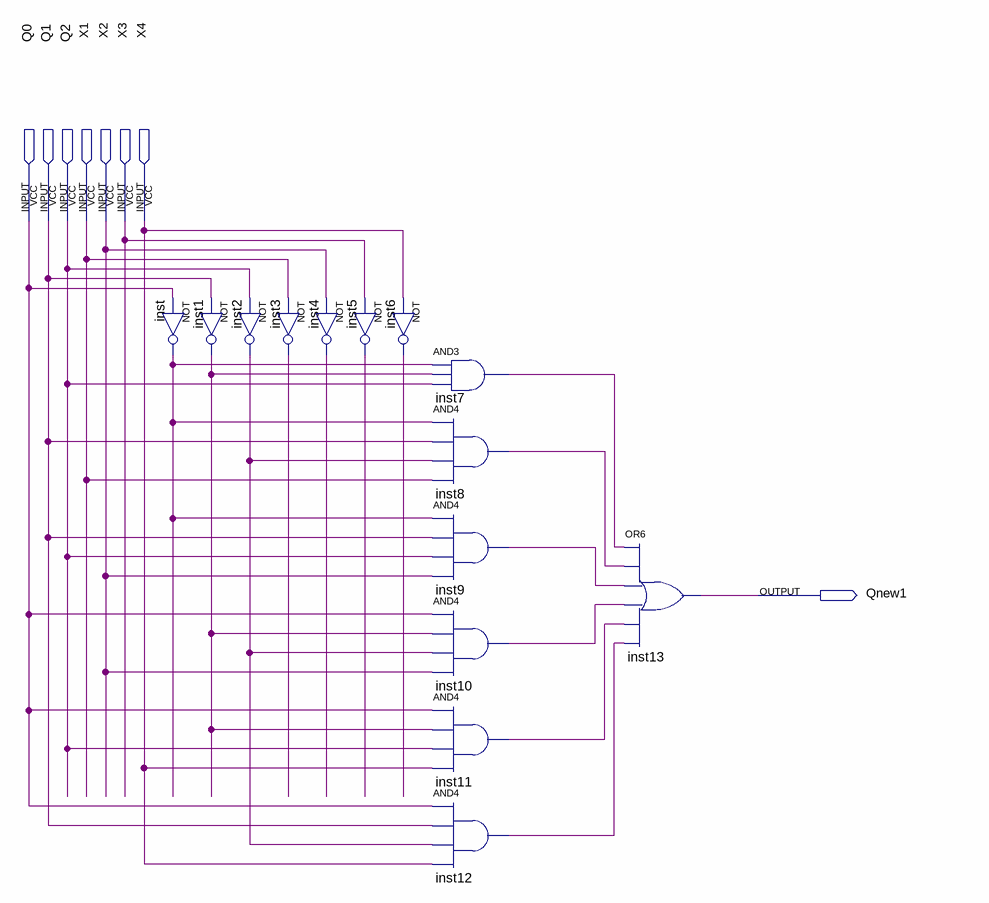
[diagram p0: schematic sheet]
// Quartus schematic Q1_n.bdf as structural Verilog: 14 symbols, 8 pins
module Q1_n (
  input  Q0,
  input  Q1,
  input  Q2,
  input  X1,
  input  X2,
  input  X3,
  input  X4,
  output Qnew1
);

  wire inst1_out, inst2_out, inst3_out, inst4_out, inst5_out, inst6_out, inst7_out, inst8_out, inst9_out,
       inst10_out, inst11_out, inst12_out, inst_out;

  not inst (inst_out, Q0);
  not inst1 (inst1_out, Q1);
  not inst2 (inst2_out, Q2);
  not inst3 (inst3_out, X1);
  not inst4 (inst4_out, X2);
  not inst5 (inst5_out, X3);
  not inst6 (inst6_out, X4);
  and inst7 (inst7_out, inst_out, inst1_out, Q2);
  and inst8 (inst8_out, inst_out, Q1, inst2_out, X1);
  and inst9 (inst9_out, inst_out, Q1, Q2, X2);
  and inst10 (inst10_out, Q0, inst1_out, inst2_out, X2);
  and inst11 (inst11_out, Q0, inst1_out, Q2, X4);
  and inst12 (inst12_out, Q0, Q1, inst2_out, X4);
  or inst13 (Qnew1, inst7_out, inst8_out, inst9_out, inst10_out, inst11_out, inst12_out);
endmodule
